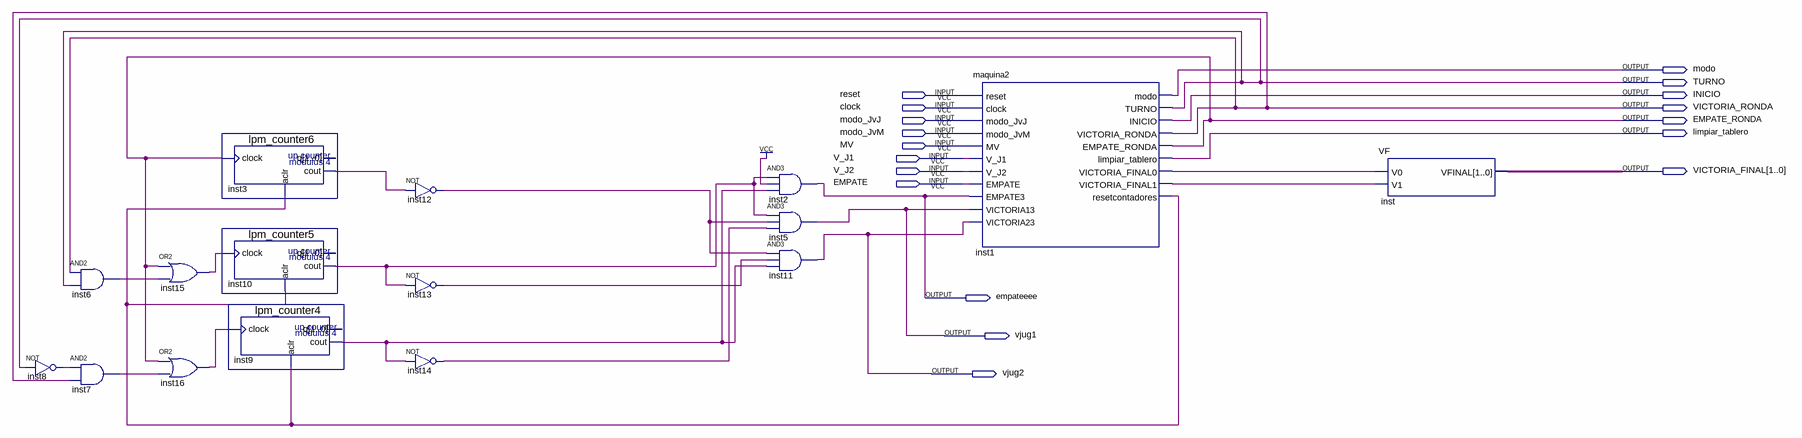
[diagram p0: schematic sheet]
// Quartus schematic MaquinaFinal1.bdf as structural Verilog: 16 symbols, 18 pins
module MaquinaFinal1 (
  input  reset,
  input  clock,
  input  modo_JvJ,
  input  modo_JvM,
  input  MV,
  input  V_J1,
  input  V_J2,
  input  EMPATE,
  output modo,
  output TURNO,
  output INICIO,
  output VICTORIA_RONDA,
  output EMPATE_RONDA,
  output limpiar_tablero,
  output [1:0] VICTORIA_FINAL,
  output empateeee,
  output vjug1,
  output vjug2
);

  wire inst1_resetcontadores, inst1_victoria_final0, inst1_victoria_final1, inst3_cout, inst6_out, inst7_out,
       inst8_out, inst9_cout, inst10_cout, inst12_out, inst13_out, inst14_out, inst15_out, inst16_out;

  and inst6 (inst6_out, VICTORIA_RONDA, TURNO);
  and inst7 (inst7_out, inst8_out, VICTORIA_RONDA);
  not inst8 (inst8_out, TURNO);
  or inst15 (inst15_out, EMPATE_RONDA, inst6_out);
  or inst16 (inst16_out, EMPATE_RONDA, inst7_out);
  lpm_counter6 inst3 (.clock(EMPATE_RONDA), .aclr(inst1_resetcontadores), .cout(inst3_cout));  // open: q
  lpm_counter5 inst10 (.clock(inst15_out), .aclr(inst1_resetcontadores), .cout(inst10_cout));  // open: q
  lpm_counter4 inst9 (.clock(inst16_out), .aclr(inst1_resetcontadores), .cout(inst9_cout));  // open: q
  not inst12 (inst12_out, inst3_cout);
  not inst13 (inst13_out, inst10_cout);
  not inst14 (inst14_out, inst9_cout);
  and inst2 (empateeee, inst10_cout, 1'b1, inst9_cout);
  and inst5 (vjug1, inst10_cout, inst12_out, inst14_out);
  and inst11 (vjug2, inst12_out, inst13_out, inst9_cout);
  maquina2 inst1 (
    .reset(reset), .clock(clock), .modo_JvJ(modo_JvJ), .modo_JvM(modo_JvM), .MV(MV), .V_J1(V_J1),
    .V_J2(V_J2), .EMPATE(EMPATE), .EMPATE3(empateeee), .VICTORIA13(vjug1), .VICTORIA23(vjug2), .modo(modo),
    .TURNO(TURNO), .INICIO(INICIO), .VICTORIA_RONDA(VICTORIA_RONDA), .EMPATE_RONDA(EMPATE_RONDA),
    .limpiar_tablero(limpiar_tablero), .VICTORIA_FINAL0(inst1_victoria_final0),
    .VICTORIA_FINAL1(inst1_victoria_final1), .resetcontadores(inst1_resetcontadores));
  VF inst (.V0(inst1_victoria_final0), .V1(inst1_victoria_final1), .VFINAL(VICTORIA_FINAL));
endmodule
